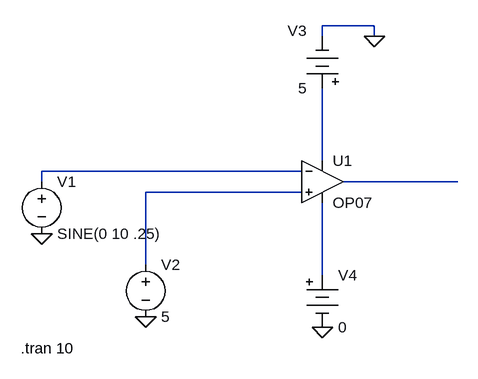
[diagram p0: schematic Op-Amp-Comparator.asc]
Op-Amp-Comparator.asc, the LTspice schematic file:
Version 4
SHEET 1 880 680
WIRE 480 -144 400 -144
WIRE 400 -128 400 -144
WIRE 480 -128 480 -144
WIRE 400 64 400 -48
WIRE 368 80 -32 80
WIRE -32 96 -32 80
WIRE 608 96 432 96
WIRE 368 112 128 112
WIRE 128 224 128 112
WIRE 400 240 400 128
FLAG 400 320 0
FLAG 480 -128 0
FLAG -32 176 0
FLAG 128 304 0
SYMBOL voltage -32 80 R0
WINDOW 123 0 0 Left 0
WINDOW 39 0 0 Left 0
SYMATTR InstName V1
SYMATTR Value SINE(0 10 .25)
SYMBOL voltage 128 208 R0
WINDOW 123 0 0 Left 0
WINDOW 39 0 0 Left 0
SYMATTR InstName V2
SYMATTR Value 5
SYMBOL Opamps\\OP07 400 32 R0
SYMATTR InstName U1
SYMBOL Misc\\battery 400 -32 R180
WINDOW 0 24 104 Left 2
WINDOW 3 24 16 Left 2
WINDOW 123 0 0 Left 0
WINDOW 39 0 0 Left 0
SYMATTR InstName V3
SYMATTR Value 5
SYMBOL Misc\\battery 400 224 R0
WINDOW 123 0 0 Left 0
WINDOW 39 0 0 Left 0
SYMATTR InstName V4
SYMATTR Value 0
TEXT -64 352 Left 2 !.tran 10

The netlist it stands for:
* Op-Amp-Comparator.asc
V1 N002 0 SINE(0 10 .25)
V2 N004 0 5
XU1 N004 N002 N001 N005 N003 LT1001  ; OP07, pins In+ In- V+ V- OUT
V3 N001 0 5
V4 N005 0 0
.tran 10
.lib LTC.lib
.backanno
.end